# Altium schematic sheet Main_MCU.SchDoc
size A4; SheetNumber: 3; SheetTotal: 7
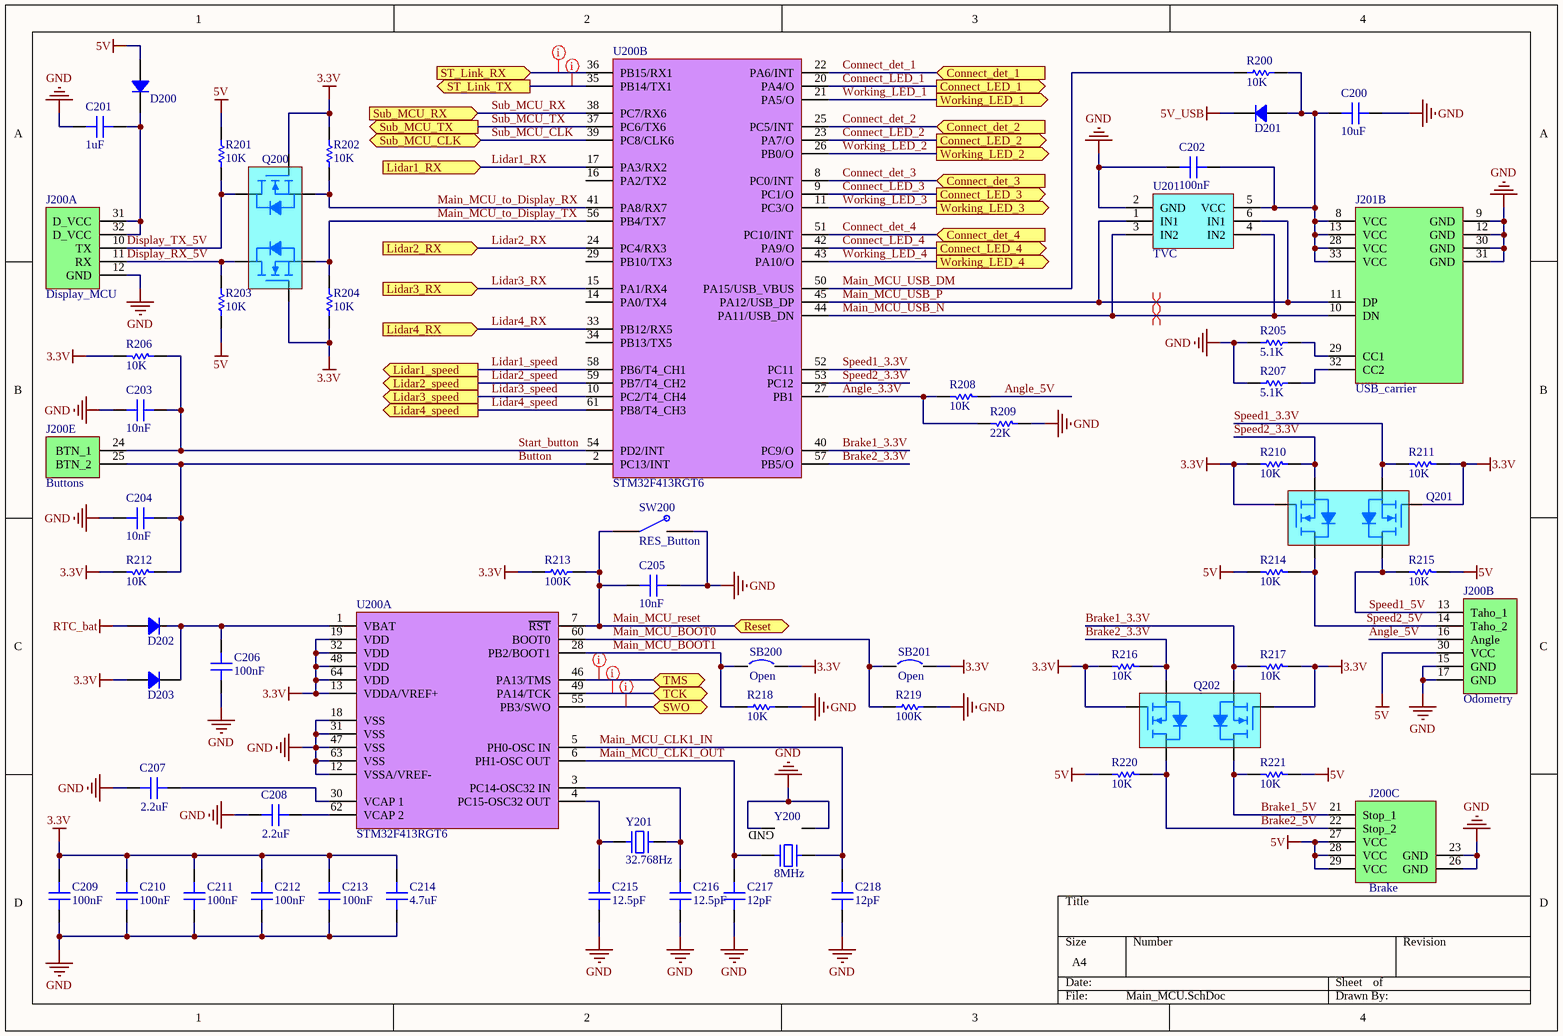
[diagram p0: Main_MCU.SchDoc]

## Parts
C200  10uF  [CAP 0603]
C201  1uF  [CAP 0603]
C202  100nF  [CAP 0603]
C203  10nF  [CAP 0603]
C204  10nF  [CAP 0603]
C205  10nF  [CAP 0603]
C206  100nF  [CAP 0603]
C207  2.2uF  [CAP 0603]
C208  2.2uF  [CAP 0603]
C209  100nF  [CAP 0603]
C210  100nF  [CAP 0603]
C211  100nF  [CAP 0603]
C212  100nF  [CAP 0603]
C213  100nF  [CAP 0603]
C214  4.7uF  [CAP 1206]
C215  12.5pF  [CAP 0603]
C216  12.5pF  [CAP 0603]
C217  12pF  [CAP 0603]
C218  12pF  [CAP 0603]
D200  (no value)  [Bourns DO214AC SMA - duplicate]
D201  (no value)  [Bourns DO214AC SMA - duplicate]
D202  (no value)  [SOD323HP]
D203  (no value)  [SOD323HP]
J200  Display_MCU  [2167010409]  (parts A,B,C,E of 6)
J201  USB_carrier  [2167010409]  (part B of 4)
Q200  Double N mos  [TI SOT-563 DRL]  (value not drawn)
Q201  Double N mos  [TI SOT-563 DRL]  (value not drawn)
Q202  Double N mos  [TI SOT-563 DRL]  (value not drawn)
R200  10K  [RES 0603]
R201  10K  [RES 0603]
R202  10K  [RES 0603]
R203  10K  [RES 0603]
R204  10K  [RES 0603]
R205  5.1K  [RES 0603]
R206  10K  [RES 0603]
R207  5.1K  [RES 0603]
R208  10K  [RES 0603]
R209  22K  [RES 0603]
R210  10K  [RES 0603]
R211  10K  [RES 0603]
R212  10K  [RES 0603]
R213  100K  [RES 0603]
R214  10K  [RES 0603]
R215  10K  [RES 0603]
R216  10K  [RES 0603]
R217  10K  [RES 0603]
R218  10K  [RES 0603]
R219  100K  [RES 0603]
R220  10K  [RES 0603]
R221  10K  [RES 0603]
SB200  Open  [SB_0603]
SB201  Open  [SB_0603]
SW200  RES_Button  [PTS636SM50JSMTRLFS]
U200  STM32F413RGT6  [QFP50P1200X1200X165-64N]  (parts A,B of 2)
U201  TVC  [DIODES SOT-23-6 W6]
Y200  8MHz  [XTAL_ECS-80-10-33-CHN-TR3]
Y201  32.768Hz  [Crystal_32.768]

## Ports
Connect_det_1 (in, see Main_scheme[2B]), Connect_det_2 (in, see Main_scheme[2B]), Connect_det_3 (in, see Main_scheme[2C]), Connect_det_4 (in, see Main_scheme[2C]), Connect_LED_1 (out, see Main_scheme[2B]), Connect_LED_2 (out, see Main_scheme[2B]), Connect_LED_3 (out, see Main_scheme[2C]), Connect_LED_4 (out, see Main_scheme[2C]), Lidar1_RX (in, see Main_scheme[2A]), Lidar1_speed (out, see Main_scheme[2A]), Lidar2_RX (in, see Main_scheme[2B]), Lidar2_speed (out, see Main_scheme[2B]), Lidar3_RX (in, see Main_scheme[2B]), Lidar3_speed (out, see Main_scheme[2C]), Lidar4_RX (in, see Main_scheme[2C]), Lidar4_speed (out, see Main_scheme[2C]), Reset (bidir, see Main_scheme[1C]), ST_Link_RX (in, see Main_scheme[1C]), ST_Link_TX (out, see Main_scheme[1C]), Sub_MCU_CLK (bidir, see Main_scheme[2A]), Sub_MCU_RX (in, see Main_scheme[2A]), Sub_MCU_TX (out, see Main_scheme[2A]), SWO (bidir, see Main_scheme[1C]), TCK (bidir, see Main_scheme[1C]), TMS (bidir, see Main_scheme[1C]), Working_LED_1 (out, see Main_scheme[2B]), Working_LED_2 (out, see Main_scheme[2B]), Working_LED_3 (out, see Main_scheme[2C]), Working_LED_4 (out, see Main_scheme[2C])

## Nets
3.3V: C209.2 C210.2 C211.2 C212.2 C213.2 C214.2 D203.1 Q200.1(G2) Q200.4(G1) Q201.1(G2) Q201.4(G1) Q202.1(G2) Q202.4(G1) R202.2 R204.1 R206.1 R210.1 R211.2 R212.1 R213.2 R216.1 R217.2 SB200.2 SB201.2 U200.13(VDDA/VREF+) U200.19(VDD) U200.32(VDD) U200.48(VDD) U200.64(VDD)
5V: D200.1 J200.27(VCC) J200.28(VCC) J200.29(VCC) J200.30(VCC) R201.2 R203.1 R214.1 R215.2 R220.1 R221.2
5V_USB: D201.2
GND: C200.2 C201.1 C202.1 C203.2 C204.2 C205.2 C206.1 C207.2 C208.2 C209.1 C210.1 C211.1 C212.1 C213.1 C214.1 C215.1 C216.1 C217.1 C218.1 J200.12(GND) J200.15(GND) J200.17(GND) J200.23(GND) J200.26(GND) J201.9(GND) J201.12(GND) J201.30(GND) J201.31(GND) R205.1 R207.1 R209.2 R218.1 R219.1 SW200.2 U200.12(VSSA/VREF-) U200.18(VSS) U200.31(VSS) U200.47(VSS) U200.63(VSS) U201.2(GND) Y200.2(GND) Y200.4(GND)
RTC_bat: D202.1
Angle_3.3V: R208.1 R209.1 U200.27(PB1)
Angle_5V: J200.16(Angle) R208.2
Brake1_3.3V: Q202.5(S1) R217.1 U200.40(PC9/O)
Brake1_5V: J200.21(Stop_1) Q202.3(D1) R221.1
Brake2_3.3V: Q202.2(S2) R216.2 U200.57(PB5/O)
Brake2_5V: J200.22(Stop_2) Q202.6(D2) R220.2
Button: C204.1 J200.25(BTN_2) R212.2 U200.2(PC13/INT)
Connect_det_1: U200.22(PA6/INT) ; port Connect_det_1
Connect_det_2: U200.25(PC5/INT) ; port Connect_det_2
Connect_det_3: U200.8(PC0/INT) ; port Connect_det_3
Connect_det_4: U200.51(PC10/INT) ; port Connect_det_4
Connect_LED_1: U200.20(PA4/O) ; port Connect_LED_1
Connect_LED_2: U200.23(PA7/O) ; port Connect_LED_2
Connect_LED_3: U200.9(PC1/O) ; port Connect_LED_3
Connect_LED_4: U200.42(PA9/O) ; port Connect_LED_4
Display_RX_5V: J200.11(RX) Q200.3(D1) R203.2
Display_TX_5V: J200.10(TX) Q200.6(D2) R201.1
Lidar1_RX: U200.17(PA3/RX2) ; port Lidar1_RX
Lidar1_speed: U200.58(PB6/T4_CH1) ; port Lidar1_speed
Lidar2_RX: U200.24(PC4/RX3) ; port Lidar2_RX
Lidar2_speed: U200.59(PB7/T4_CH2) ; port Lidar2_speed
Lidar3_RX: U200.15(PA1/RX4) ; port Lidar3_RX
Lidar3_speed: U200.10(PC2/T4_CH4) ; port Lidar3_speed
Lidar4_RX: U200.33(PB12/RX5) ; port Lidar4_RX
Lidar4_speed: U200.61(PB8/T4_CH3) ; port Lidar4_speed
Main_MCU_BOOT0: R219.2 SB201.1 U200.60(BOOT0)
Main_MCU_BOOT1: R218.2 SB200.1 U200.28(PB2/BOOT1)
Main_MCU_CLK1_IN: C218.2 U200.5(PH0-OSC_IN) Y200.3
Main_MCU_CLK1_OUT: C217.2 U200.6(PH1-OSC_OUT) Y200.1
Main_MCU_reset: C205.1 R213.1 SW200.1 U200.7(~{RST}) ; port Reset
Main_MCU_to_Display_RX: Q200.2(S2) R202.1 U200.41(PA8/RX7)
Main_MCU_to_Display_TX: Q200.5(S1) R204.2 U200.56(PB4/TX7)
Main_MCU_USB_DM: R200.2 U200.50(PA15/USB_VBUS)
Main_MCU_USB_N: J201.10(DN) U200.44(PA11/USB_DN) U201.3(IN2) U201.4(IN2)
Main_MCU_USB_P: J201.11(DP) U200.45(PA12/USB_DP) U201.1(IN1) U201.6(IN1)
Speed1_3.3V: Q201.5(S1) R211.1 U200.52(PC11)
Speed1_5V: J200.13(Taho_1) Q201.3(D1) R215.1
Speed2_3.3V: Q201.2(S2) R210.2 U200.53(PC12)
Speed2_5V: J200.14(Taho_2) Q201.6(D2) R214.2
ST_Link_RX: U200.36(PB15/RX1) ; port ST_Link_RX
ST_Link_TX: U200.35(PB14/TX1) ; port ST_Link_TX
Start_button: C203.1 J200.24(BTN_1) R206.2 U200.54(PD2/INT)
Sub_MCU_CLK: U200.39(PC8/CLK6) ; port Sub_MCU_CLK
Sub_MCU_RX: U200.38(PC7/RX6) ; port Sub_MCU_RX
Sub_MCU_TX: U200.37(PC6/TX6) ; port Sub_MCU_TX
SWO: U200.55(PB3/SWO) ; port SWO
TCK: U200.49(PA14/TCK) ; port TCK
TMS: U200.46(PA13/TMS) ; port TMS
Working_LED_1: U200.21(PA5/O) ; port Working_LED_1
Working_LED_2: U200.26(PB0/O) ; port Working_LED_2
Working_LED_3: U200.11(PC3/O) ; port Working_LED_3
Working_LED_4: U200.43(PA10/O) ; port Working_LED_4
NetC200_1: C200.1 C202.2 D201.1 J201.8(VCC) J201.13(VCC) J201.28(VCC) J201.33(VCC) R200.1 U201.5(VCC)
NetC201_2: C201.2 D200.2 J200.31(D_VCC) J200.32(D_VCC)
NetC206_2: C206.2 D202.2 D203.2 U200.1(VBAT)
NetC207_1: C207.1 U200.30(VCAP_1)
NetC208_1: C208.1 U200.62(VCAP_2)
NetC215_2: C215.2 U200.4(PC15-OSC32_OUT) Y201.1
NetC216_2: C216.2 U200.3(PC14-OSC32_IN) Y201.2
NetJ201_29: J201.29(CC1) R205.2
NetJ201_32: J201.32(CC2) R207.2

Not connected (* = marked no-connect by the designer): U200 14(PA0/TX4) 16(PA2/TX2) 29(PB10/TX3) 34(PB13/TX5)

## Layout directives
differential pair: Main_MCU_USB_N, Main_MCU_USB_P
net class Main_MCU_SWD: SWO, TCK, TMS
net class Main_MCU_UART: ST_Link_RX, ST_Link_TX

## Library data of the parts
C200-C218 = Capacitor: SMT Capacitor
  C200: Value: 10uF
  C201: Value: 1uF
  C202 C206 C209-C213: Value: 100nF
  C203-C205: Value: 10nF
  C207 C208: Value: 2.2uF
  C214: Value: 4.7uF
  C215 C216: Value: 12.5pF
  C217 C218: Value: 12pF
D200-D203 = Diode: Rectifier Diode
J200 = AUX_carrier
R200-R221 = Res: Resistor; Ordered by: Subcon; Published: 8-Jun-2000; Revision: July-2002: Re-released for DXP Platform.; Publisher: Altium Limited
  R200-R204 R206 R208 R210-R212 R214-R218 R220 R221: Value: 10K
  R205 R207: Value: 5.1K
  R209: Value: 22K
  R213 R219: Value: 100K
SB200 SB201 = Circuit Breaker: Published: 24-Mar-1999; Revision: July-2002: Re-released for DXP Platform.; Publisher: Altium Limited
U200 = CMP-12105-000025-1: IC MCU 32BIT 1MB FLASH 64LQFP; Manufacturer: STMicroelectronics; Max Supply Voltage: 3.6V; Number Of Uart Channels: 7; Data Bus Width: 32bits; Number Of Pwm Channels: 32; Max Junction Temp: +105°C; Number Of A/D Converters: 1; Core Architecture: ARM Cortex-M4; Number Of Timers/Counters: 15; Min Supply Voltage: 1.7V; Memory Size: 1MBytes; Standoff Height: 0.05mm; Number Of Spi Channels: 5; Number Of Adc Channels: 16; Number Of I2C Channels: 4; Ram Size: 320KBytes; Interface: I2C,SPI,UART,USART,CAN,USB,LIN,IrDA,I2S,Other; Frequency: 100MHz; Number Of I/Os: 50; Nominal Supply Current: 25-180mA; Ambient Temperature Range High: +85°C; Ipc Land Pattern Name: QFP50P1200X1200X160-64; Temperature Range High: +105°C; Lead Free: Yes; Ambient Temperature Range Low: -40°C; Digikey Description: IC MCU 32BIT 1MB FLASH 64LQFP; Device Class L3: Microcontrollers; Temperature: -40°C to +105°C; Temperature Range Low: -40°C; Number Of Cores: 1; ComponentLink2Description: Datasheet; Category: IC; Device Class L1: Integrated Circuits (ICs); Package: LQFP64-5W; Height: 1.6mm; ComponentLink2URL: http://www.st.com/content/ccc/resource/technical/document/datasheet/group3/f6/1d/4a/d9/f9/96/43/2a/DM00282249/files/DM00282249.pdf/jcr:content/translations/en.DM00282249.pdf; Manufacturer Part Number: STM32F413RGT6; RoHS: TRUE; Memory Type: FLASH; Number Of Usb Channels: 1; Device Class L2: Embedded Processors and Controllers; Automotive: No; Octopart: https://octopart.com/stm32f413rgt6-stmicroelectronics-76512522
U201 = USB_TVC_protection
Y200 = Crystal 8Mhz: SMT Crystal; Value: 8MHz
Y201 = Crystal_32.768Hz: SMT Crystal; Value: 32.768Hz